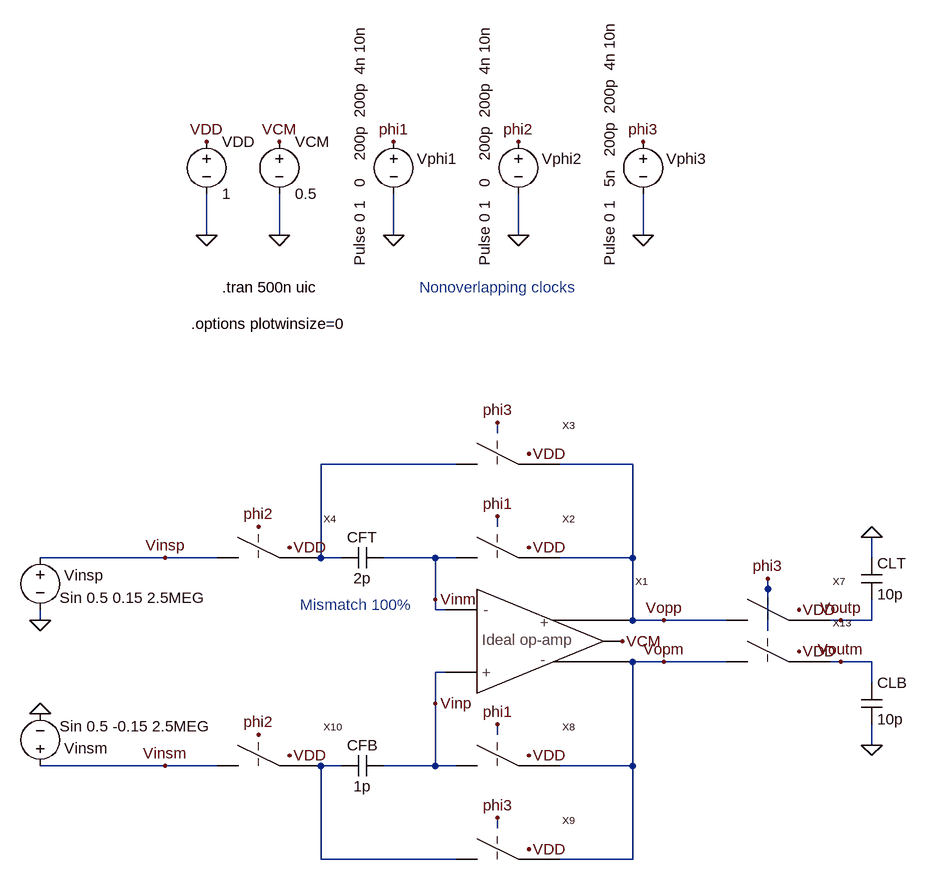
[diagram p0: schematic _Fig2_40_mismatch_MSD.asc]
_Fig2_40_mismatch_MSD.asc, the LTspice schematic file:
Version 4
SHEET 1 2964 696
WIRE 1312 -2624 1312 -2688
WIRE 1424 -2624 1424 -2688
WIRE 1600 -2624 1600 -2688
WIRE 1792 -2624 1792 -2688
WIRE 1984 -2624 1984 -2688
WIRE 1760 -2320 1760 -2336
WIRE 1696 -2272 1488 -2272
WIRE 1968 -2272 1856 -2272
WIRE 1760 -2176 1760 -2192
WIRE 1248 -2128 1056 -2128
WIRE 1328 -2128 1248 -2128
WIRE 1488 -2128 1488 -2272
WIRE 1520 -2128 1488 -2128
WIRE 1664 -2128 1584 -2128
WIRE 1696 -2128 1664 -2128
WIRE 1968 -2128 1968 -2272
WIRE 1968 -2128 1856 -2128
WIRE 2336 -2128 2336 -2160
WIRE 2176 -2080 2176 -2096
WIRE 1664 -2064 1664 -2128
WIRE 1664 -2048 1664 -2064
WIRE 1680 -2048 1664 -2048
WIRE 1056 -2032 1056 -2048
WIRE 1968 -2032 1968 -2128
WIRE 2016 -2032 1968 -2032
WIRE 2112 -2032 2016 -2032
WIRE 2288 -2032 2272 -2032
WIRE 2336 -2032 2336 -2064
WIRE 2336 -2032 2288 -2032
WIRE 2176 -2016 2176 -2080
WIRE 2016 -1968 1968 -1968
WIRE 2112 -1968 2016 -1968
WIRE 2288 -1968 2272 -1968
WIRE 2336 -1968 2288 -1968
WIRE 1680 -1952 1664 -1952
WIRE 2336 -1936 2336 -1968
WIRE 1664 -1904 1664 -1952
WIRE 1760 -1856 1760 -1872
WIRE 2336 -1840 2336 -1872
WIRE 1248 -1808 1056 -1808
WIRE 1328 -1808 1248 -1808
WIRE 1520 -1808 1488 -1808
WIRE 1664 -1808 1664 -1904
WIRE 1664 -1808 1584 -1808
WIRE 1696 -1808 1664 -1808
WIRE 1968 -1808 1968 -1968
WIRE 1968 -1808 1856 -1808
WIRE 1760 -1712 1760 -1728
WIRE 1488 -1664 1488 -1808
WIRE 1696 -1664 1488 -1664
WIRE 1968 -1664 1968 -1808
WIRE 1968 -1664 1856 -1664
FLAG 1600 -2624 0
FLAG 1600 -2768 phi1
FLAG 1312 -2624 0
FLAG 1312 -2768 VDD
FLAG 1792 -2624 0
FLAG 1792 -2768 phi2
FLAG 1424 -2624 0
FLAG 1424 -2768 VCM
FLAG 1984 -2624 0
FLAG 1984 -2768 phi3
FLAG 1808 -2288 VDD
FLAG 1808 -2144 VDD
FLAG 1760 -2336 phi3
FLAG 1760 -2192 phi1
FLAG 1440 -2144 VDD
FLAG 1392 -2176 phi2
FLAG 1248 -2128 Vinsp
FLAG 1952 -2000 VCM
FLAG 2016 -2032 Vopp
FLAG 2224 -2048 VDD
FLAG 2176 -2096 phi3
FLAG 2336 -2160 0
FLAG 1056 -2032 0
FLAG 1808 -1680 VDD
FLAG 1808 -1824 VDD
FLAG 1760 -1728 phi3
FLAG 1760 -1872 phi1
FLAG 1440 -1824 VDD
FLAG 1248 -1808 Vinsm
FLAG 2016 -1968 Vopm
FLAG 2224 -1984 VDD
FLAG 2336 -1840 0
FLAG 1056 -1888 0
FLAG 2288 -1968 Voutm
FLAG 2288 -2032 Voutp
FLAG 1664 -2064 Vinm
FLAG 1664 -1904 Vinp
FLAG 1392 -1856 phi2
SYMBOL Ideal_differential_op_amp 1728 -2000 R0
SYMATTR InstName X1
SYMBOL voltage 1600 -2784 R0
WINDOW 0 36 42 Left 0
WINDOW 3 -52 207 VLeft 0
WINDOW 123 0 0 Left 0
WINDOW 39 0 0 Left 0
SYMATTR InstName Vphi1
SYMATTR Value Pulse 0 1   0    200p  200p  4n 10n
SYMBOL voltage 1312 -2784 R0
WINDOW 123 0 0 Left 0
WINDOW 39 0 0 Left 0
SYMATTR InstName VDD
SYMATTR Value 1
SYMBOL voltage 1792 -2784 R0
WINDOW 0 36 42 Left 0
WINDOW 3 -52 207 VLeft 0
WINDOW 123 0 0 Left 0
WINDOW 39 0 0 Left 0
SYMATTR InstName Vphi2
SYMATTR Value Pulse 0 1   0    200p  200p  4n 10n
SYMBOL voltage 1424 -2784 R0
WINDOW 123 0 0 Left 0
WINDOW 39 0 0 Left 0
SYMATTR InstName VCM
SYMATTR Value 0.5
SYMBOL voltage 1984 -2784 R0
WINDOW 0 36 42 Left 0
WINDOW 3 -52 207 VLeft 0
WINDOW 123 0 0 Left 0
WINDOW 39 0 0 Left 0
SYMATTR InstName Vphi3
SYMATTR Value Pulse 0 1   5n   200p  200p  4n 10n
SYMBOL switch_1 1696 -2112 R0
SYMATTR InstName X2
SYMBOL switch_1 1696 -2256 R0
SYMATTR InstName X3
SYMBOL cap 1520 -2112 R270
WINDOW 0 32 32 VTop 0
WINDOW 3 0 32 VBottom 0
SYMATTR InstName CFT
SYMATTR Value 2p
SYMBOL switch_1 1328 -2112 R0
SYMATTR InstName X4
SYMBOL switch_1 2112 -2016 R0
SYMATTR InstName X7
SYMBOL cap 2320 -2128 R0
SYMATTR InstName CLT
SYMATTR Value 10p
SYMBOL voltage 1056 -2144 R0
WINDOW 0 37 43 Left 0
WINDOW 3 30 77 Left 0
WINDOW 123 0 0 Left 0
WINDOW 39 0 0 Left 0
SYMATTR InstName Vinsp
SYMATTR Value Sin 0.5 0.15 2.5MEG
SYMBOL switch_1 1696 -1792 R0
SYMATTR InstName X8
SYMBOL switch_1 1696 -1648 R0
SYMATTR InstName X9
SYMBOL cap 1520 -1824 M90
WINDOW 0 0 32 VBottom 0
WINDOW 3 32 32 VTop 0
SYMATTR InstName CFB
SYMATTR Value 1p
SYMBOL switch_1 1328 -1792 R0
SYMATTR InstName X10
SYMBOL switch_1 2112 -1952 R0
SYMATTR InstName X13
SYMBOL cap 2320 -1872 M180
WINDOW 0 24 64 Left 0
WINDOW 3 24 8 Left 0
SYMATTR InstName CLB
SYMATTR Value 10p
SYMBOL voltage 1056 -1792 M180
WINDOW 0 37 43 Left 0
WINDOW 3 30 77 Left 0
WINDOW 123 0 0 Left 0
WINDOW 39 0 0 Left 0
SYMATTR InstName Vinsm
SYMATTR Value Sin 0.5 -0.15 2.5MEG
TEXT 1336 -2544 Left 0 !.tran 500n uic
TEXT 1640 -2544 Left 0 ;Nonoverlapping clocks
TEXT 1456 -2056 Left 0 ;Mismatch 100%
TEXT 1288 -2488 Left 0 !.options plotwinsize=0

The netlist it stands for:
* _Fig2_40_mismatch_MSD.asc
XX1 Vinm Vinp Vopp VCM Vopm Ideal_differential_op_amp  ; pins Vinm Vinp Outp VCM Outm
Vphi1 phi1 0 Pulse 0 1   0    200p  200p  4n 10n
VDD VDD 0 1
Vphi2 phi2 0 Pulse 0 1   0    200p  200p  4n 10n
VCM VCM 0 0.5
Vphi3 phi3 0 Pulse 0 1   5n   200p  200p  4n 10n
XX2 Vinm Vopp phi1 VDD switch_1  ; pins P1 P2 clk VDD
XX3 N001 Vopp phi3 VDD switch_1  ; pins P1 P2 clk VDD
CFT N001 Vinm 2p
XX4 Vinsp N001 phi2 VDD switch_1  ; pins P1 P2 clk VDD
XX7 Vopp Voutp phi3 VDD switch_1  ; pins P1 P2 clk VDD
CLT 0 Voutp 10p
Vinsp Vinsp 0 Sin 0.5 0.15 2.5MEG
XX8 Vinp Vopm phi1 VDD switch_1  ; pins P1 P2 clk VDD
XX9 N002 Vopm phi3 VDD switch_1  ; pins P1 P2 clk VDD
CFB N002 Vinp 1p
XX10 Vinsm N002 phi2 VDD switch_1  ; pins P1 P2 clk VDD
XX13 Vopm Voutm phi3 VDD switch_1  ; pins P1 P2 clk VDD
CLB 0 Voutm 10p
Vinsm Vinsm 0 Sin 0.5 -0.15 2.5MEG
.tran 500n uic
* Nonoverlapping clocks
* Mismatch 100%
.options plotwinsize=0
.backanno
.end